# Altium schematic sheet 电冰箱停电保护电路设计原理图.SchDoc
size A4
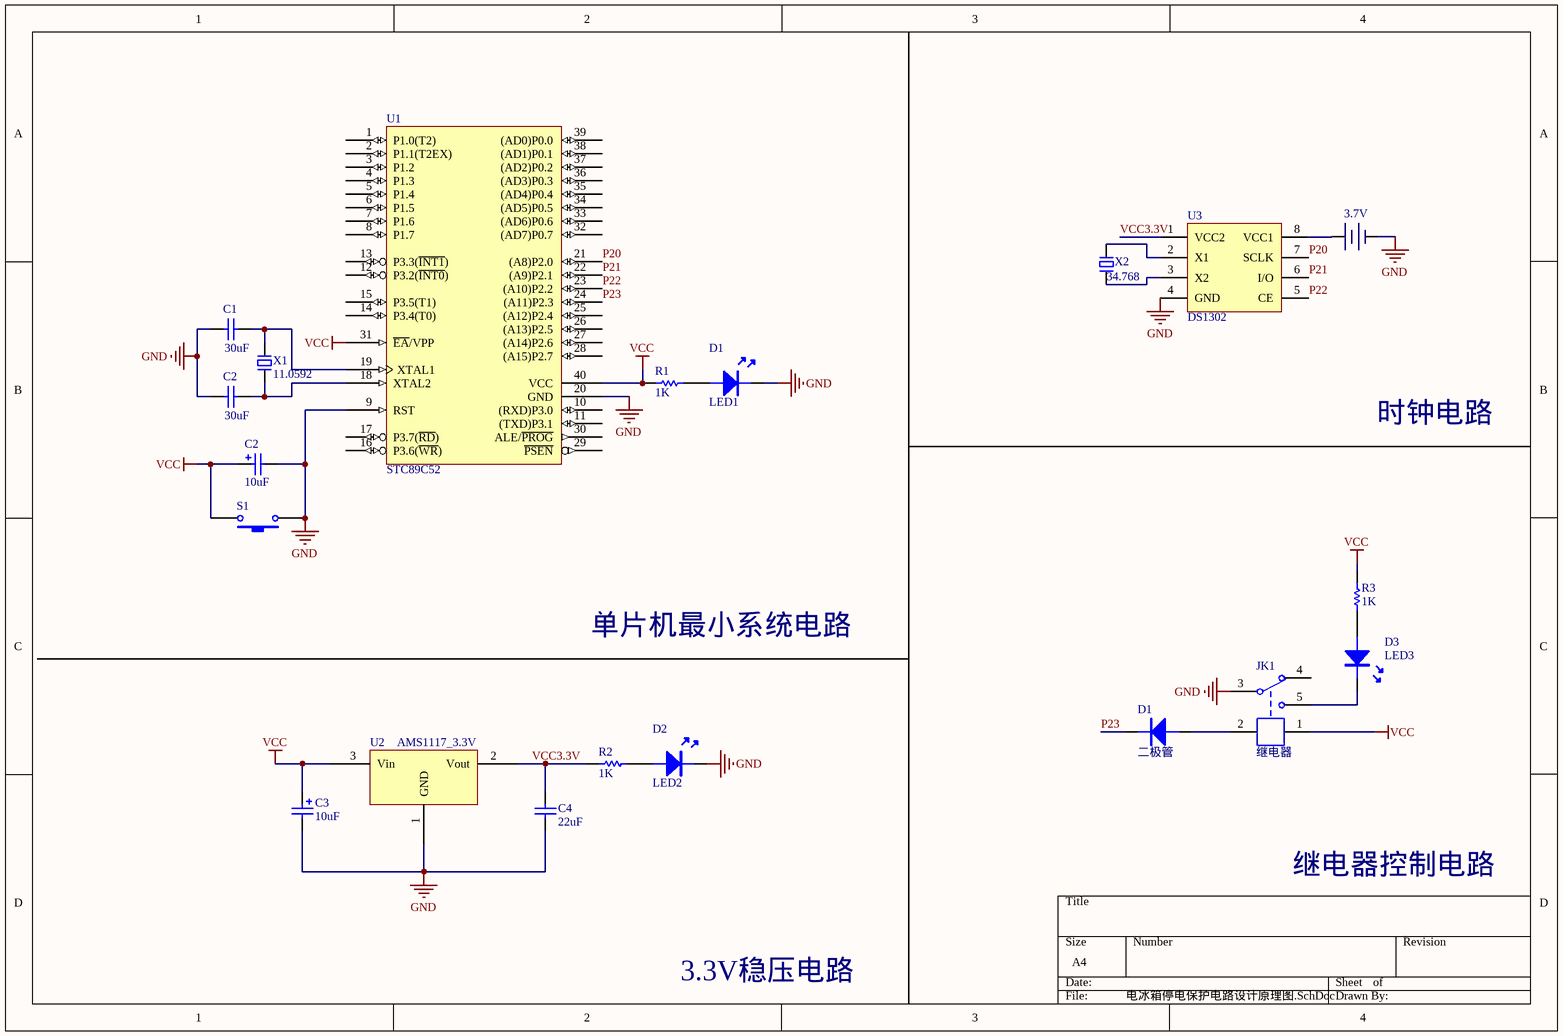
[diagram p0: 电冰箱停电保护电路设计原理图.SchDoc]

## Parts
(Parts that share a designator on the sheet are numbered #1, #2 ... from top to bottom, then left to right.)
3.7V  CR2032  [CR2032-A]  (value not drawn)
C1  value 30uF  [C1206]  (hidden comment: Cap Semi)
C2#1  value 30uF  [C1206]  (hidden comment: Cap Semi)
C2#2  value 10uF  [POLAR0.8]  (hidden comment: Cap Pol2)
C3  value 10uF  [POLAR0.8]  (hidden comment: Cap Pol2)
C4  value 22uF  [C1206]  (hidden comment: Cap Semi)
D1#1  LED1  [LED5-BLUE]
D1#2  二极管  [DO-15]
D2  LED2  [LED5-BLUE]
D3  LED3  [LED5-BLUE]
JK1  继电器  [SRD-C_BK]
R1  1K  [0201R]
R2  1K  [0201R]
R3  1K  [0201R]
S1  SW-PB  [SPST-2]  (value not drawn)
U1  STC89C52  [DIP40]
U2  AMS1117_3.3V  [SOT223]
U3  DS1302  [SOP8]
X1  11.0592  [OSC HC-49S]
X2  34.768  [OSC HC-49S]

## Nets
GND: 3.7V.2 C1.1 C2#1.1 C2#2.2 C3.2 C4.1 D1#1.K D2.K JK1.3 S1.1 U1.9(RST) U1.20(GND) U2.1(GND) U3.4(GND)
VCC: C2#2.1 C3.1 JK1.1 R1.1 R3.1 S1.2 U1.31(~{EA}/VPP) U1.40(VCC) U2.3(Vin)
P20: U1.21((A8)P2.0) U3.7(SCLK)
P21: U1.22((A9)P2.1) U3.6(I/O)
P22: U1.23((A10)P2.2) U3.5(CE)
P23: D1#2.K U1.24((A11)P2.3)
VCC3.3V: C4.2 R2.1 U2.2(Vout) U3.1(VCC2)
Net3.7V_1: 3.7V.1 U3.8(VCC1)
NetC1_2: C1.2 U1.19(XTAL1) X1.2
NetC2#1_2: C2#1.2 U1.18(XTAL2) X1.1
NetD1#1_A: D1#1.A R1.2
NetD1#2_A: D1#2.A JK1.2
NetD2_A: D2.A R2.2
NetD3_A: D3.A R3.2
NetD3_K: D3.K JK1.5
NetU3_2: U3.2(X1) X2.2
NetU3_3: U3.3(X2) X2.1

Not connected (* = marked no-connect by the designer): JK1 4; U1 1(P1.0(T2)) 2(P1.1(T2EX)) 3(P1.2) 4(P1.3) 5(P1.4) 6(P1.5) 7(P1.6) 8(P1.7) 10((RXD)P3.0) 11((TXD)P3.1) 12(P3.2(~{INT0})) 13(P3.3(~{INT1})) 14(P3.4(T0)) 15(P3.5(T1)) 16(P3.6(~{WR})) 17(P3.7(~{RD})) 25((A12)P2.4) 26((A13)P2.5) 27((A14)P2.6) 28((A15)P2.7) 29(~{PSEN}) 30(ALE/~{PROG}) 32((AD7)P0.7) 33((AD6)P0.6) 34((AD5)P0.5) 35((AD4)P0.4) 36((AD3)P0.3) 37((AD2)P0.2) 38((AD1)P0.1) 39((AD0)P0.0)

## Notes on the sheet
- 时钟电路
- 单片机最小系统电路
- 继电器控制电路
- 3.3V稳压电路

## Library data of the parts
C1 C2#1 C4 = Cap Semi: Capacitor (Semiconductor SIM Model); Published: 8-Jun-2000; LatestRevisionDate: 29-May-2009; LatestRevisionNote: IPC-7351 Footprint Added.; PackageReference: C1206; Publisher: Altium Limited; PackageDescription: Chip Capacitor
C2#2 C3 = Cap Pol2: Polarized Capacitor (Axial); Published: 8-Jun-2000; LatestRevisionDate: 17-Jul-2002; LatestRevisionNote: Re-released for DXP Platform.; PackageReference: POLAR0.8; Publisher: Altium Limited; PackageDescription: Polarized Capacitor; 2 Leads
D1#1 D2 D3 = LED
D1#2 = DIODE: 普通二极管
JK1 = SRD-S-105D: 5V一组转换
R1-R3 = RES
S1 = SW-PB: Switch; Published: 24-Mar-1999; LatestRevisionDate: 17-Jul-2002; LatestRevisionNote: Re-released for DXP Platform.; PackageReference: SPST-2; Publisher: Altium Limited; PackageDescription: Switch; 2 Leads
U2 = AMS1117: 三端稳压芯片
X1 X2 = XTAL-2P: 2脚无源脚晶振